# EAGLE schematic bc-tag-humidity (EAGLE 7.6.0)
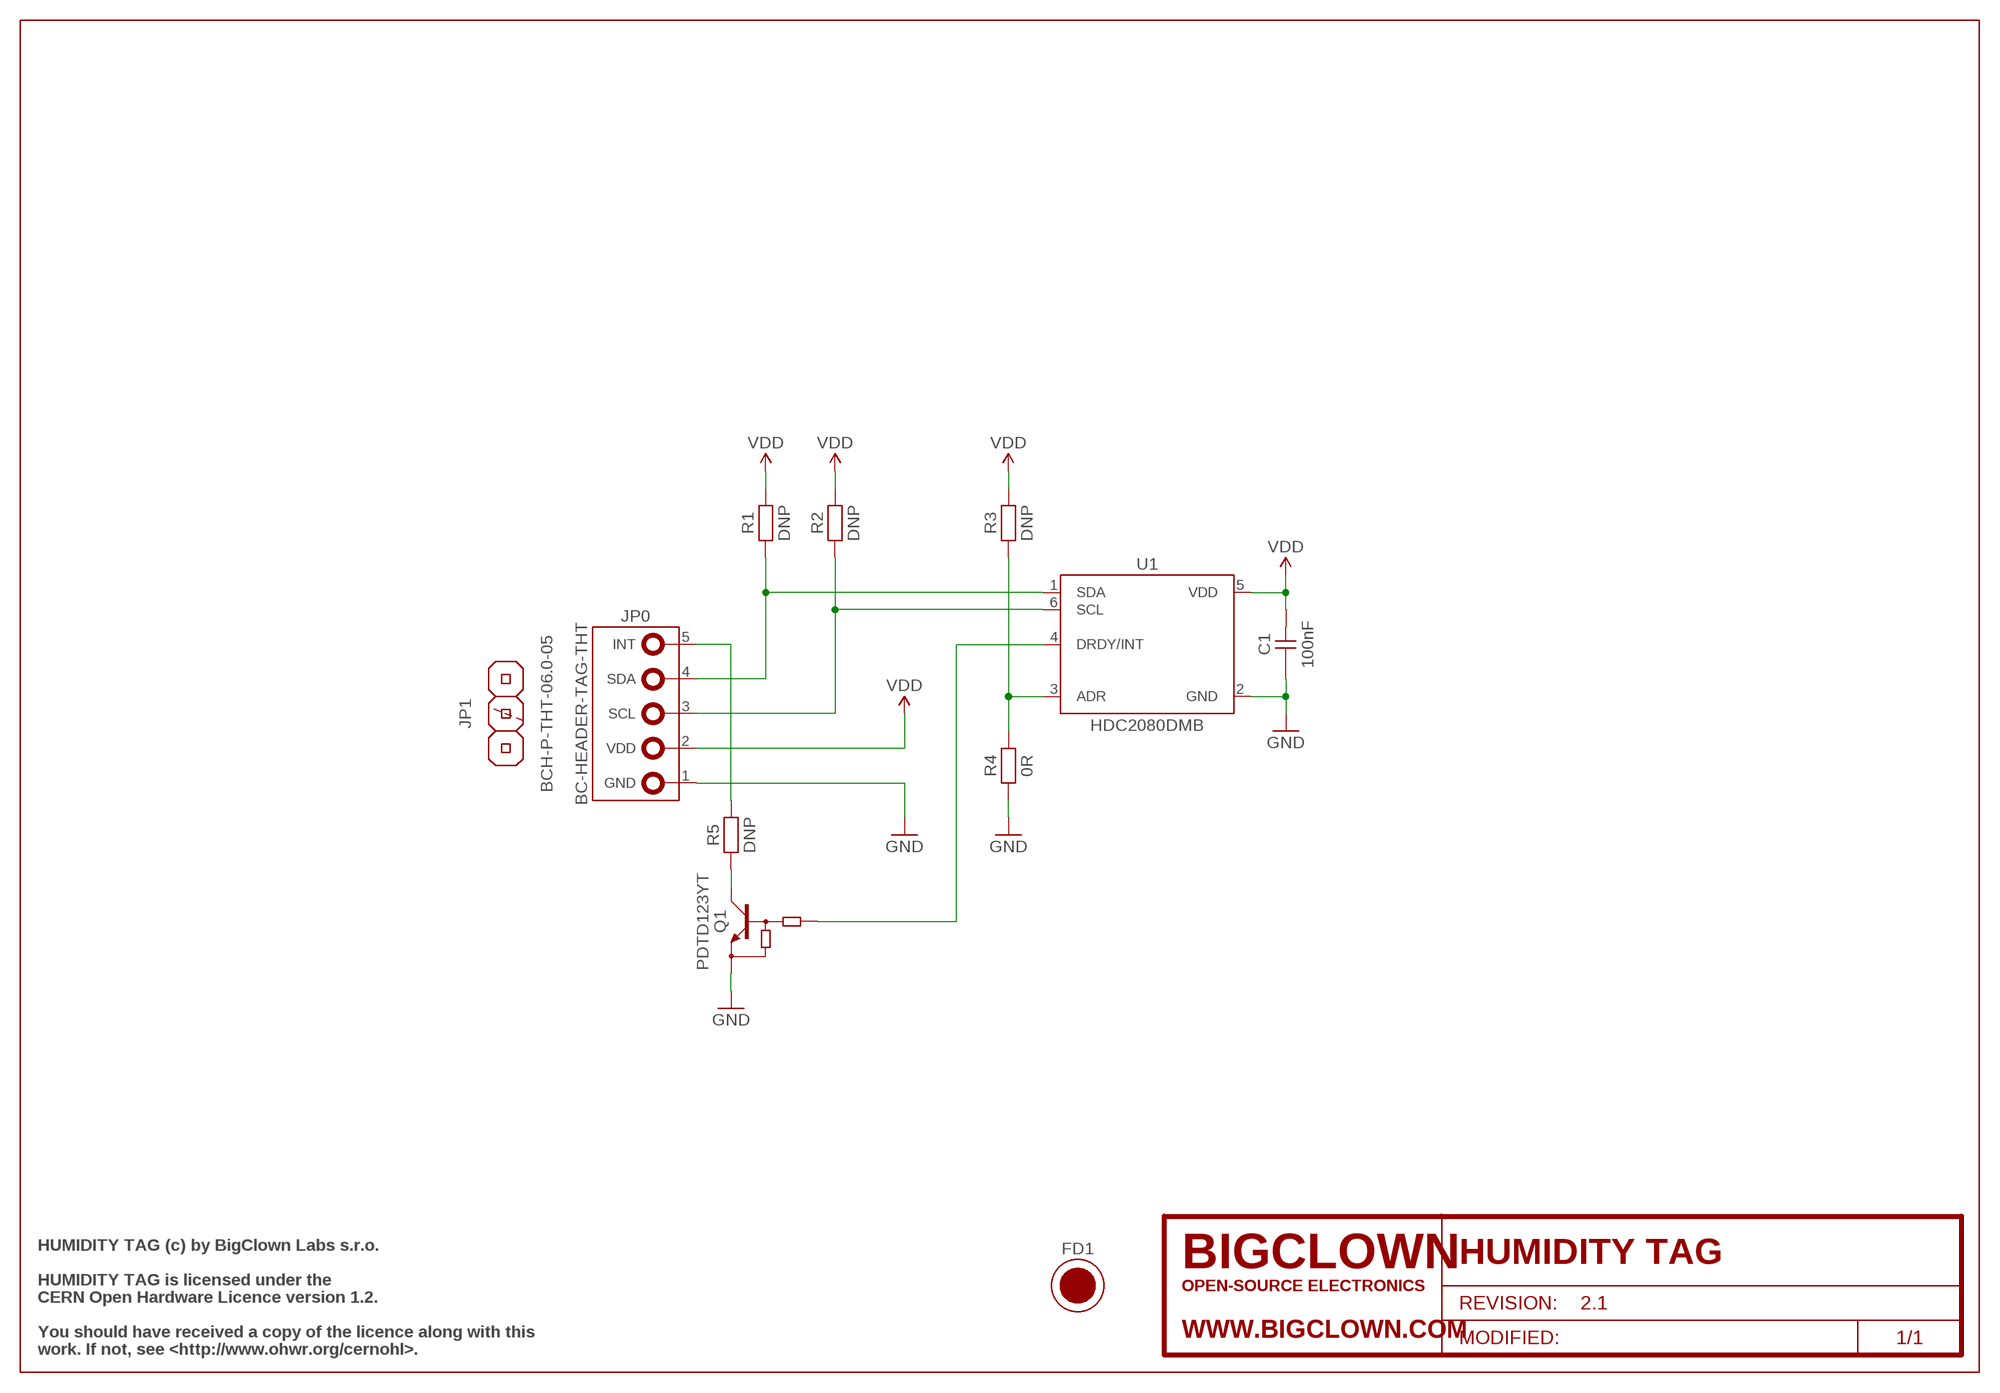
[diagram p0: schematic, sheet 1]

## Parts
C1  100nF  C-0805-100NF  [CAPACITOR-0805_R]
FD1  FIDUCIAL  [FIDUCIAL-1MM]
FRAME1  FRAME-SCH/A4L-BRD/A4L  [FRAME-A4L]
JP0  BC-HEADER-TAG-THT  [BC-HEADER-TAG-THT]
JP1  BCH-P-THT-06.0-05  JP-BCH-P-THT-06.0-05  [BCH-P-THT-05]
Q1  PDTD123YT  Q-PDTD123YT  [SOT-23_R]
R1  DNP  R-0805-DNP  [RESISTOR-0805_R]
R2  DNP  R-0805-DNP  [RESISTOR-0805_R]
R3  DNP  R-0805-DNP  [RESISTOR-0805_R]
R4  0R  R-0805-0R  [RESISTOR-0805_R]
R5  DNP  R-0805-DNP  [RESISTOR-0805_R]
U1  HDC2080DMB  U-HDC2080DMB  [HDC2080DMB_R]

## Nets
ADR: R3.1 R4.2 U1.3(ADR)
DRDY/INT: Q1.1(B) U1.4(DRDY/INT)
DRDY/INT#: Q1.3(C) R5.1
GND: C1.2 JP0.1(GND) Q1.2(E) R4.1 U1.2(GND)
INT: JP0.5(INT) R5.2
SCL: JP0.3(SCL) R2.1 U1.6(SCL)
SDA: JP0.4(SDA) R1.1 U1.1(SDA)
VDD: C1.1 JP0.2(VDD) R1.2 R2.2 R3.2 U1.5(VDD)

## Notes on the sheet
- HUMIDITY TAG (c) by BigClown Labs s.r.o.
- HUMIDITY TAG is licensed under the
- CERN Open Hardware Licence version 1.2.
- You should have received a copy of the licence along with this
- work. If not, see <http://www.ohwr.org/cernohl>.

## Library data of the parts
C1 = bc-capacitor:C-0805-100NF; BCPN: BC-C-0805-100NF
FD1 = bc-fiducial:FIDUCIAL; BCPN: -
FRAME1 = bc-frame:FRAME-SCH/A4L-BRD/A4L; BCPN: -; PROJECT_NAME: HUMIDITY TAG; PROJECT_REVISION: 2.1
JP0 = bc-header:BC-HEADER-TAG-THT; BCPN: -
JP1 = bc-header:JP-BCH-P-THT-06.0-05; BCPN: BC-JP-BCH-P-THT-06.0-05
Q1 = bc-discrete:Q-PDTD123YT; BCPN: BC-Q-PDTD123YT
R1-R3 R5 = bc-resistor:R-0805-DNP; BCPN: -
R4 = bc-resistor:R-0805-0R; BCPN: BC-R-0805-0R
U1 = bc-sensor:U-HDC2080DMB; BCPN: BC-U-HDC2080DMB